# EAGLE design Tracksoar v2  (EAGLE 9.3.0)
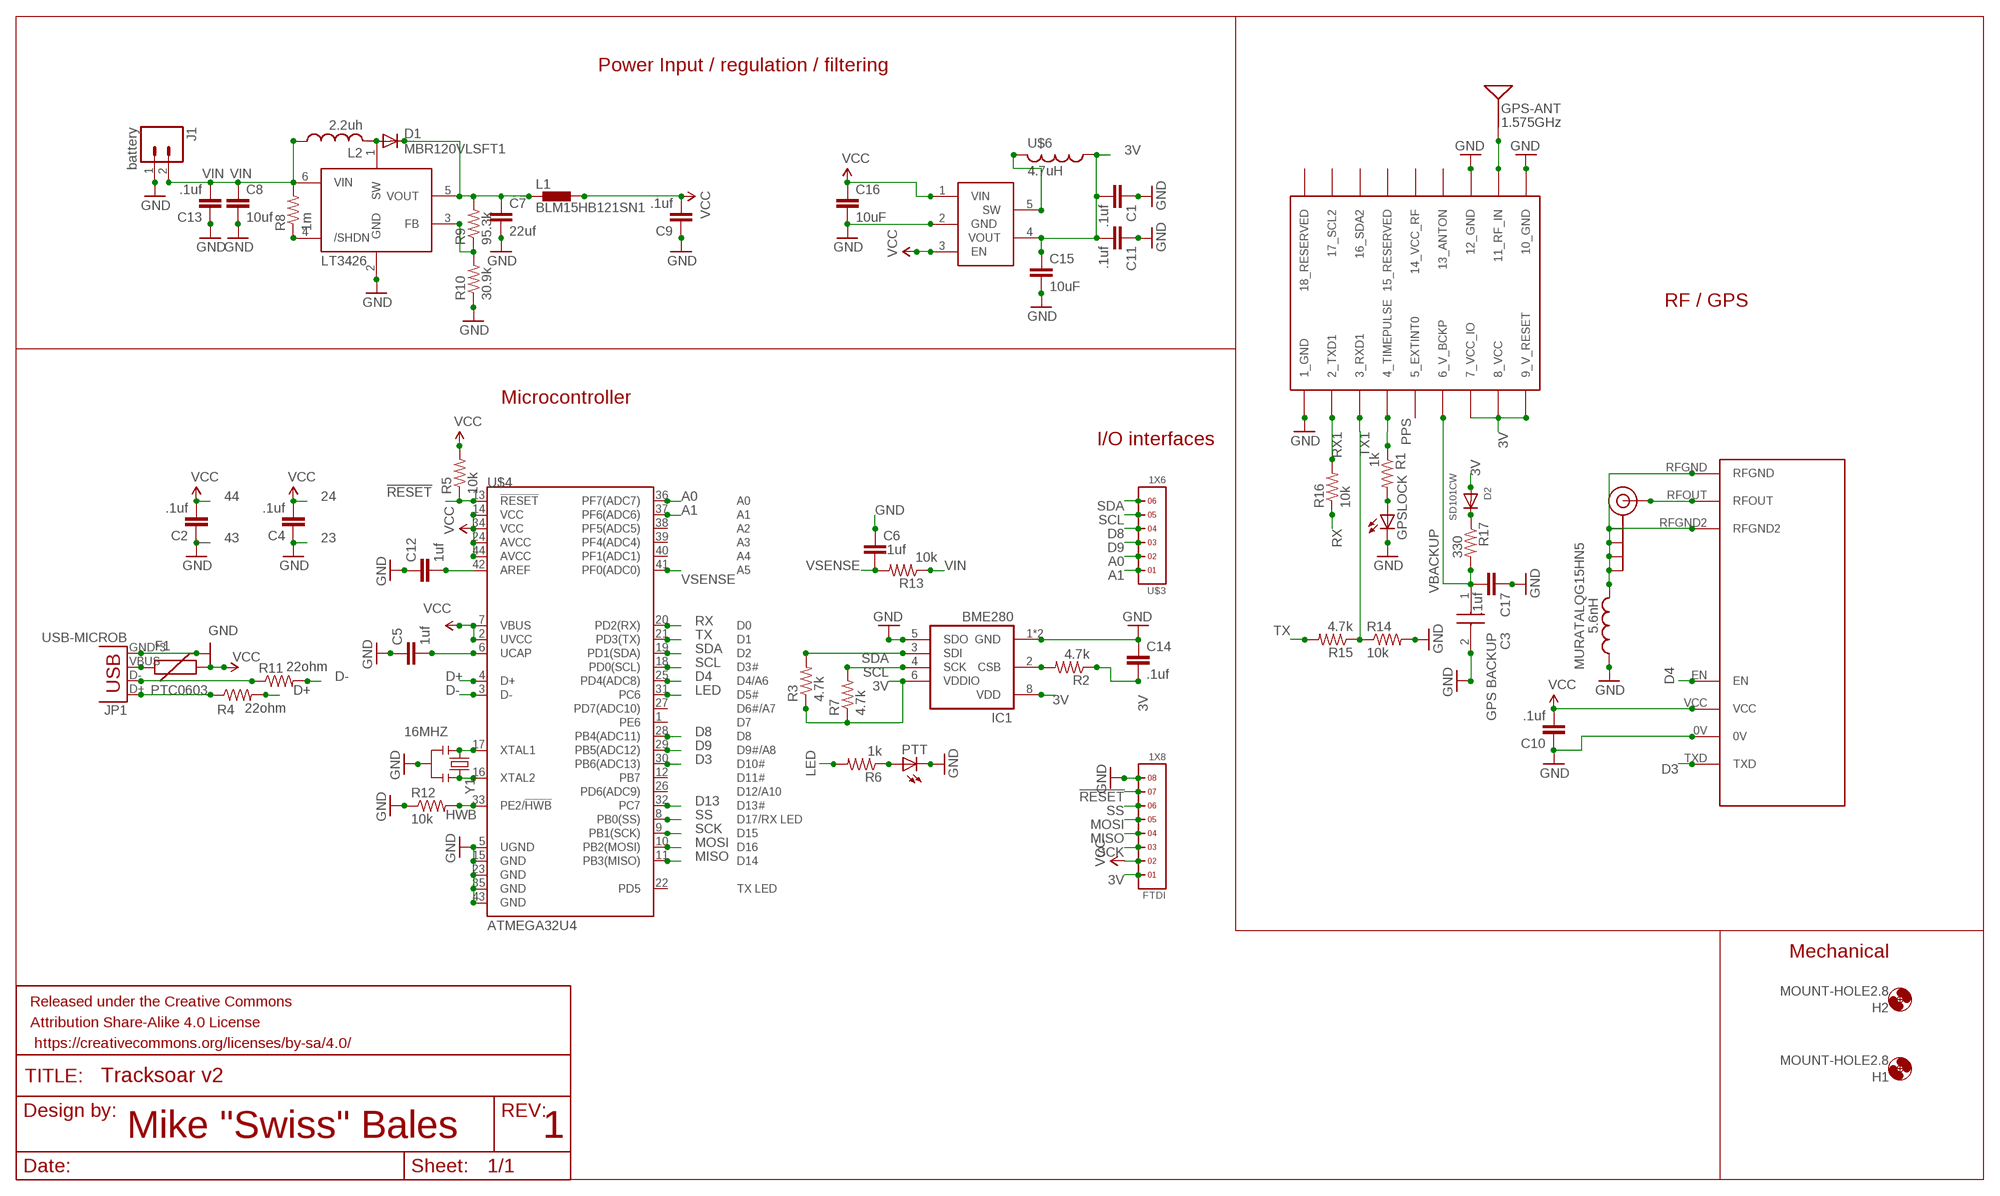
[diagram p0: schematic, sheet 1]

## Parts
C1  .1uf  CAP0402-CAP  [0402-CAP]
C2  .1uf  CAP0402-CAP  [0402-CAP]
C3  GPS BACKUP  DSK-3R3H204T614-H2L  [DSK-3R3H204T614-H2L]
C4  .1uf  CAP0402-CAP  [0402-CAP]
C5  1uf  CAP0402-CAP  [0402-CAP]
C6  .1uf  CAP0402-CAP  [0402-CAP]
C7  22uf  CAP0805  [0805]
C8  10uf  CAP0805  [0805]
C9  .1uf  CAP0402-CAP  [0402-CAP]
C10  .1uf  CAP0402-CAP  [0402-CAP]
C11  .1uf  CAP0402-CAP  [0402-CAP]
C12  1uf  CAP0402-CAP  [0402-CAP]
C13  .1uf  CAP0402-CAP  [0402-CAP]
C14  .1uf  CAP0402-CAP  [0402-CAP]
C15  10uF  10UF-0603-6.3V-20%  [0603]
C16  10uF  10UF-0603-6.3V-20%  [0603]
C17  .1uf  CAP0402-CAP  [0402-CAP]
D1  MBR120VLSFT1  DIODE-SOD123  [SOD123]
D2  SD101CW  DIODESOD-123  [SOD-123]
F1  PTC0603  [0603]
FRAME1  FRAME-LETTER  [CREATIVE_COMMONS]
FTDI  1X8  [1X8]
GPS-ANT  1.575GHz  ANTENNAGPS-2X7MM  [ANT-GPS-2X7MM]
GPSLOCK  LEDCHIP-LED0603  [CHIP-LED0603]
H1  MOUNT-HOLE2.8  [2,8]
H2  MOUNT-HOLE2.8  [2,8]
IC1  BME280  [BME280]
J1  battery  M02JST-PTH-2  [JST-2-PTH]
J$1  SMA_EDGE  [SMA-EDGE]
JP1  USB-MICROB  [USB-MICROB]
L1  BLM15HB121SN1  [0402]
L2  2.2uh  L-USL1812  [L1812]
LT3426  LT3426  [SOT23-6]
MURATALQG15HN5  5.6nH  INDUCTOR_0402_N  [RESC0402_N]
PTT  LEDCHIP-LED0603  [CHIP-LED0603]
R1  1k  R-US_R0402  [R0402]
R2  4.7k  R-US_R0402  [R0402]
R3  4.7k  R-US_R0402  [R0402]
R4  22ohm  R-US_R0402  [R0402]
R5  10k  R-US_R0402  [R0402]
R6  1k  R-US_R0402  [R0402]
R7  4.7k  R-US_R0402  [R0402]
R8  1m  R-US_R0402  [R0402]
R9  95.3k  R-US_R0402  [R0402]
R10  30.9k  R-US_R0402  [R0402]
R11  22ohm  R-US_R0402  [R0402]
R12  10k  R-US_R0402  [R0402]
R13  10k  R-US_R0402  [R0402]
R14  10k  R-US_R0402  [R0402]
R15  4.7k  R-US_R0402  [R0402]
R16  10k  R-US_R0402  [R0402]
R17  330  R-US_R0402  [R0402]
U$1  UBLOX_MAX  [UBLOX_MAX]
U$2  RADIOMETRIX-HX1  [RADIOMETRIX-HX1]
U$3  1X6  [1X6]
U$4  ATMEGA32U4  ATMEGA32U4QFN2  [QFN-44-NOPAD]
U$5  PAM2305  PAM2305-33SOT23-5  [DBV_R-PDSO-G5]
U$6  4.7uH  INDUCTOR_0805_N  [RESC0805_N]
Y1  16MHZ  RESONATOR16MHZ  [RESONATOR-SMD]

## Nets
3V: C1.2 C11.2 C14.2 C15.1 D2.A FTDI.1 IC1.6(VDDIO) IC1.8(VDD) R2.1 R3.1 R7.1 U$1.7_VCC_IO U$1.8_VCC U$1.9_V_RESET U$5.4(VOUT) U$6.1
!RESET: FTDI.7 R5.1 U$4.13(!RESET)
A0: U$3.2 U$4.36(PF7(ADC7))
A1: U$3.1 U$4.37(PF6(ADC6))
D3: U$2.TXD U$4.30(PB6(ADC13))
D4: U$2.EN U$4.25(PD4(ADC8))
D8: U$3.4 U$4.28(PB4(ADC11))
D9: U$3.3 U$4.29(PB5(ADC12))
D13: U$4.32(PC7)
D+: R4.2 U$4.4(D+)
D-: R11.2 U$4.3(D-)
GND: C1.1 C2.1 C3.2(-) C4.1 C5.1 C6.1 C7.2 C8.2 C9.1 C10.1 C11.1 C12.1 C13.1 C14.1 C15.2 C16.2 C17.1 FTDI.8 GPSLOCK.C IC1.1(GND) IC1.5(SDO) IC1.7(GND) J1.1 JP1.GND JP1.MT1(GND) JP1.MT2(GND) LT3426.2(GND) MURATALQG15HN5.1 PTT.C R10.1 R12.1 R14.2 U$1.1_GND U$1.10_GND U$1.12_GND U$2.0V U$4.5(UGND) U$4.15(GND) U$4.23(GND) U$4.35(GND) U$4.43(GND) U$5.2(GND) Y1.2
HWB: R12.2 U$4.33(PE2/!HWB)
LED: R6.2 U$4.31(PC6)
MISO: FTDI.4 U$4.11(PB3(MISO))
MOSI: FTDI.5 U$4.10(PB2(MOSI))
N$1: J$1.SIG(SIGNAL) U$2.RFOUT
N$2: IC1.2(CSB) R2.2
N$3: GPSLOCK.A R1.2
N$6: GPS-ANT.1(SIGNAL) U$1.11_RF_IN
N$7: JP1.D- R11.1
N$8: JP1.D+ R4.1
N$9: D1.A L2.2 LT3426.1(SW)
N$12: LT3426.4(/SHDN) R8.1
N$13: LT3426.3(FB) R9.1 R10.2
N$14: F1.1 JP1.VBUS
N$17: C12.2 U$4.42(AREF)
N$19: C7.1 D1.C L1.1 LT3426.5(VOUT) R9.2
N$20: C5.2 U$4.6(UCAP)
N$21: U$5.5(SW) U$6.2
N$22: D2.C R17.1
N$27: PTT.A R6.1
PPS: R1.1 U$1.4_TIMEPULSE
RFGND: J$1.GND@0(GND) J$1.GND@1(GND) J$1.GND@2(GND) J$1.GND@3(GND) MURATALQG15HN5.2 U$2.RFGND U$2.RFGND2
RX: R16.1 U$4.20(PD2(RX))
RX1: R16.2 U$1.2_TXD1
SCK: FTDI.3 U$4.9(PB1(SCK))
SCL: IC1.4(SCK) R7.2 U$3.5 U$4.18(PD0(SCL))
SDA: IC1.3(SDI) R3.2 U$3.6 U$4.19(PD1(SDA))
SS: FTDI.6 U$4.8(PB0(SS))
TX: R15.2 U$4.21(PD3(TX))
TX1: R14.1 R15.1 U$1.3_RXD1
VBACKUP: C3.1(+) C17.2 R17.2 U$1.6_V_BCKP
VCC: C2.2 C4.2 C9.2 C10.2 C16.1 F1.2 FTDI.2 L1.2 R5.2 U$2.VCC U$4.2(UVCC) U$4.7(VBUS) U$4.14(VCC) U$4.24(AVCC) U$4.34(VCC) U$4.44(AVCC) U$5.1(VIN) U$5.3(EN)
VIN: C8.1 C13.2 J1.2 L2.1 LT3426.6(VIN) R8.2 R13.1
VSENSE: C6.2 R13.2 U$4.41(PF0(ADC0))
XTAL1: U$4.17(XTAL1) Y1.1
XTAL2: U$4.16(XTAL2) Y1.3
Unconnected: U$1.5_EXTINT0 U$1.13_ANTON U$1.14_VCC_RF U$1.15_RESERVED U$1.16_SDA2 U$1.17_SCL2 U$1.18_RESERVED U$4.1(PE6) U$4.12(PB7) U$4.22(PD5) U$4.26(PD6(ADC9)) U$4.27(PD7(ADC10)) U$4.38(PF5(ADC5)) U$4.39(PF4(ADC4)) U$4.40(PF1(ADC1))

## Notes on the sheet
- Power Input / regulation / filtering
- RF / GPS
- Microcontroller
- I/O interfaces
- 44 | 24
- 43 | 23
- Mechanical
- Mike "Swiss" Bales | 1

## Library data of the parts
C1 C2 C4 C5 C7-C14 C17 = SparkFun-Capacitors:CAP: Capacitor Standard 0603 ceramic capacitor, and 0.1" leaded capacitor.
C3 = DSK-3R3H204T614-H2L:DSK-3R3H204T614-H2L: Coin cell capacitor Source: Datasheet <http://www.elna.co.jp/en/capacitor/double_layer/catalog/pdf/ds_e.pdf>; ARROW_PART_NUMBER: DSK-3R3H204T614-H2L; DESCRIPTION: Coin cell capacitor; HEIGHT: mm; MANUFACTURER_NAME: Elna; MANUFACTURER_PART_NUMBER: DSK-3R3H204T614-H2L
C6 = SparkFun-Passives:CAP: Capacitor Standard 0603 ceramic capacitor, and 0.1" leaded capacitor.
C15 C16 = SparkFun-Capacitors:10UF: 10.0µF ceramic capacitors A capacitor is a passive two-terminal electrical component used to store electrical energy temporarily in an electric field.; PROD_ID: CAP-11015
D1 = diode:DIODE-: DIODE
D2 = adafruit:DIODE: Diode SMADIODE - SMA Surface Mount Package 20V 1A Schottky Diode Digikey: 641-1014-6-ND DO-1N4148 - Through Hole Small Current Diode SOD-123 20V 1 A (.5mV Vf) Schottky Diode - Digikey: MBRX120TPMSCT-ND SOD-323 10V 570mA (.38mV Vf, 3ns) Schottky Diode - Digikey: ZLLS410CT-ND SOD-523 30V 30mA Schottky Diode (RB751S-40TE61) - Digikey: RB751S-40TE61CT-ND SOT23-R/W - SOT23 Package (R = Solder Paste/Reflow Ovens, W = Hand-Soldering) BAT54Film 40V 300mA - Digikey: 497-7162-1-ND
F1 = SparkFun-PowerIC:PTC: Resettable Fuse PTC Resettable Fuse. Spark Fun Electronics SKU : COM-08357
FRAME1 = SparkFun-Aesthetics:FRAME-LETTER: Schematic Frame Standard 8.5x11 US Letter frame
FTDI = headers(2mm):1X8
GPS-ANT = SparkFun-GPS:ANTENNA: Single-ended Antennae 1.575GHz antennae with just one terminal. These are all chip antennae. 1575MHz (GPS) Antennae ANT-GPS-2X7MM - 2.0 x 7.0 mm chip antenna. (SparkFun Product <https://www.sparkfun.com/products/9131>) ANT-GPS-2X8MM - 2.0 x 8.0 mm chip antenna. (SparkFun Product <https://www.sparkfun.com/products/8418>); PROD_ID: ANT-09087; SF_ID: GPS-09131
GPSLOCK PTT = adafruit:LED: LED OSRAM: - CHIPLED LG R971, LG N971, LY N971, LG Q971, LY Q971, LO R971, LY R971 LH N974, LH R974 LS Q976, LO Q976, LY Q976 LO Q996 - Hyper CHIPLED LW Q18S LB Q993, LB Q99A, LB R99A - SideLED LS A670, LO A670, LY A670, LG A670, LP A670 LB A673, LV A673, LT A673, LW A673 LH A674 LY A675 LS A676, LA A676, LO A676, LY A676, LW A676 LS A679, LY A679, LG A679 - Hyper Micro SIDELED® LS Y876, LA Y876, LO Y876, LY Y876 LT Y87S - SmartLED LW L88C, LW L88S LB L89C, LB L89S, LG L890 LS L89K, LO L89K, LY L89K LS L896, LA L896, LO L896, LY L896 - TOPLED LS T670, LO T670, LY T670, LG T670, LP T670 LSG T670, LSP T670, LSY T670, LOP T670, LYG T670 LG T671, LOG T671, LSG T671 LB T673, LV T673, LT T673, LW T673 LH T674 LS T676, LA T676, LO T676, LY T676, LB T676, LH T676, LSB T676, LW T676 LB T67C, LV T67C, LT T67C, LS T67K, LO T67K, LY T67K, LW E67C LS E67B, LA E67B, LO E67B, LY E67B, LB E67C, LV E67C, LT E67C LW T67C LS T679, LY T679, LG T679 LS T770, LO T770, LY T770, LG T770, LP T770 LB T773, LV T773, LT T773, LW T773 LH T774 LS E675, LA E675, LY E675, LS T675 LS T776, LA T776, LO T776, LY T776, LB T776 LHGB T686 LT T68C, LB T68C - Hyper Mini TOPLED® LB M676 - Mini TOPLED Santana® LG M470 LS M47K, LO M47K, LY M47K Source: http://www.osram.convergy.de/
H1 H2 = holes:MOUNT-HOLE: MOUNTING HOLE with drill center marker
IC1 = bosch-bme280:BME280: DIGITAL HUMIDITY, PRESSURE AND TEMPERATURE SENSOR * Digital interface I²C (up to 3.4 MHz) and SPI (3 and 4 wire, up to 10 MHz)* Supply voltage VDD main supply voltage range: 1.71 V to 3.6 V*VDDIO interface voltage range: 1.2 V to 3.6 V Operating range -40…+85 °C, 0…100 % rel. humidity, 300…1100 hPa The library has been designed by Richard Magdycz <https://www.facebook.com/groups/eaglecadsoftUK>
J1 = SparkFun-Connectors:M02: Standard 2-pin 0.1" header. Use with - straight break away headers ( PRT-00116) - right angle break away headers (PRT-00553) - swiss pins (PRT-00743) - machine pins (PRT-00117) - female headers (PRT-00115) Molex polarized connector foot print use with: PRT-08233 with associated crimp pins and housings. 2.54_SCREWTERM for use with PRT-10571. 3.5mm Screw Terminal footprints for PRT-08084 5mm Screw Terminal footprints for use with PRT-08432; PROD_ID: CONN-09863; SKU: PRT-09914
J$1 = SparkFun-Connectors:SMA_EDGE: SMA Antenna Connector End launch SMA connector. The paste layer has been removed so that the connector can be hand soldered onto the board after reflow.
JP1 = SparkFun-Connectors:USB: USB Connectors USB-B-PTH is fully proven SKU : PRT-00139/CONN-08278 USB-miniB is fully proven SKU : PRT-00587 USB-A-PCB is untested. USB-A-H is throughly reviewed, but untested. Spark Fun Electronics SKU : PRT-00437 USB-B-SMT is throughly reviewed, but untested. Needs silkscreen touching up. USB-A-S has not been used/tested USB-MB-H has not been used/tested USB-MICROB has been used. CONN-09505; PROD_ID: CONN-09505
L1 = inductors:BLM15H: EMIFIL (R) Chip Ferrite Bead for GHz Noise Source: http://www.murata.com/ Ferrite Bead BLM15H.pdf
L2 = resistor:L-US: INDUCTOR, American symbol
LT3426 = adafruit:LT3426: LT3426 1.2MHz, 2A boost converter in SOT-23 http://www.linear.com/pc/productDetail.jsp?navId=H0,C1,C1003,C1042,C1031,C1061,P8430 (Linear website)
MURATALQG15HN5 U$6 = Nordic_nRF:INDUCTOR: Generic chip inductor
R1-R17 = adafruit:R-US_: RESISTOR, American symbol
U$1 = Ava:UBLOX_MAX: UBLOX MAX
U$2 = Ava:RADIOMETRIX-HX1
U$3 = headers(2mm):1X6
U$4 = SparkFun-DigitalIC:ATMEGA32U4: Atmel 44-pin 8-bit Microcontroller with 32KBytes of ISP Flash and USB Controller
U$5 = PAM2305-33:PAM2305-33
Y1 = SparkFun-FreqCtrl:RESONATOR: Resonator Small SMD resonator. Used, eg, on the Arduino Pro/ Pro Mini boards. 8MHz- XTAL-08895 16MHz- XTAL-08900; PROD_ID: XTAL-08900

## Board
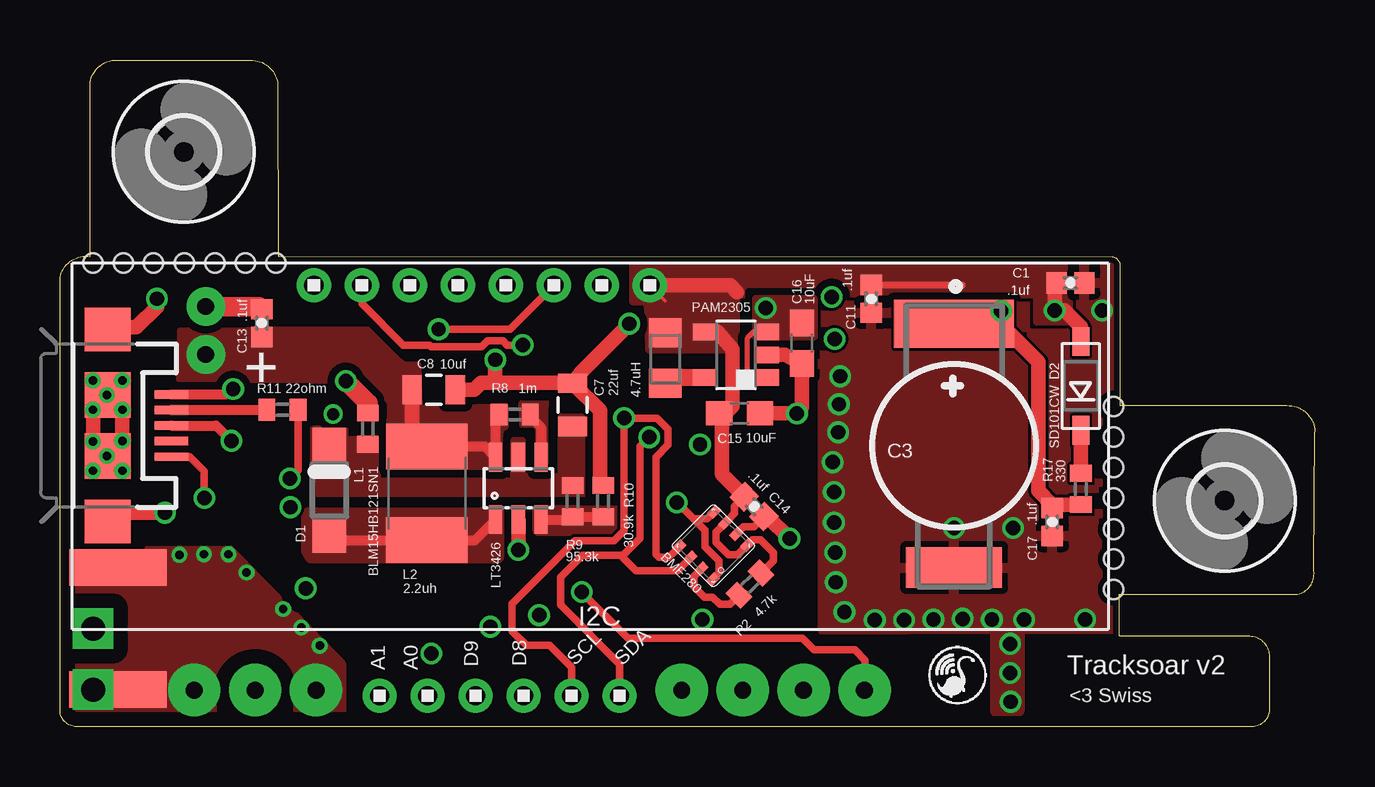
[diagram p1: board, top side]
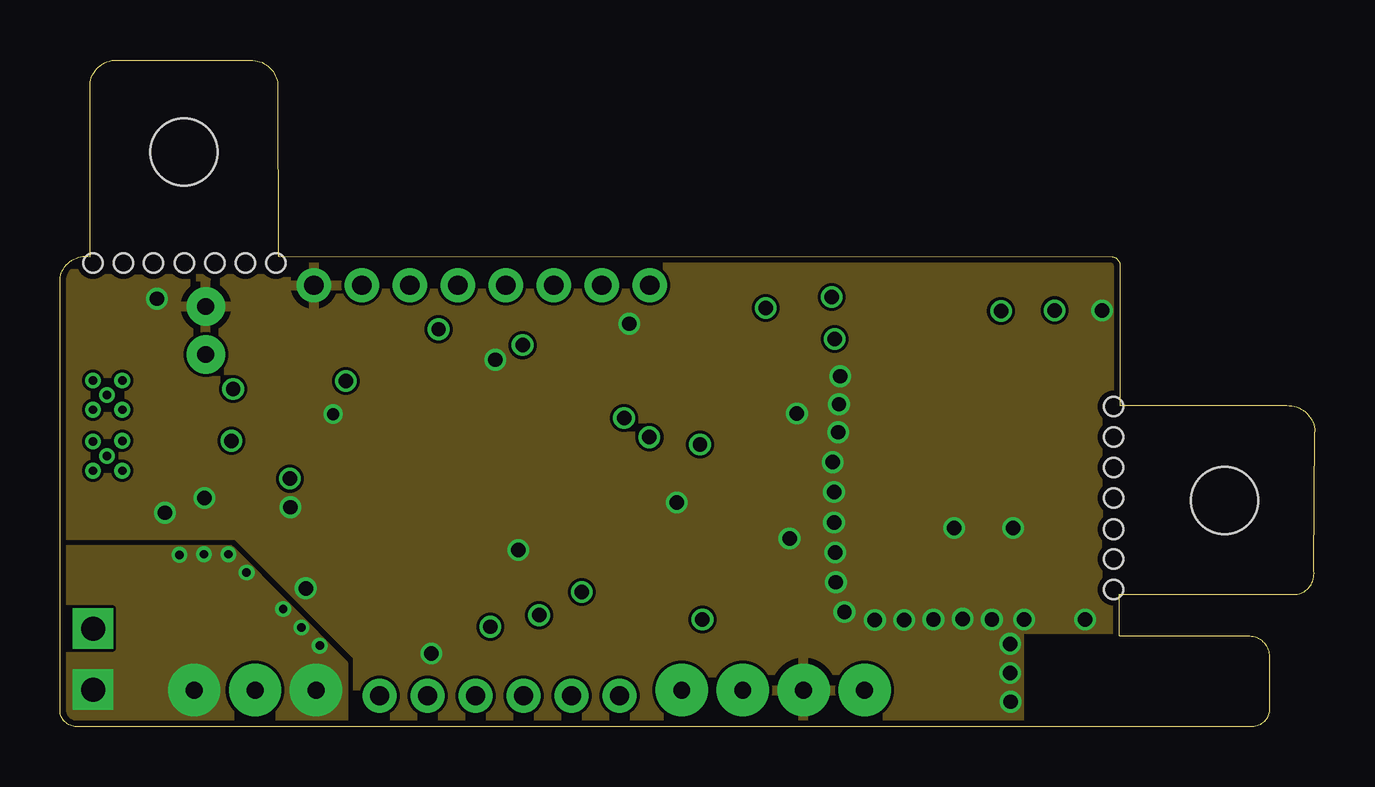
[diagram p2: board, inner layer Route2]
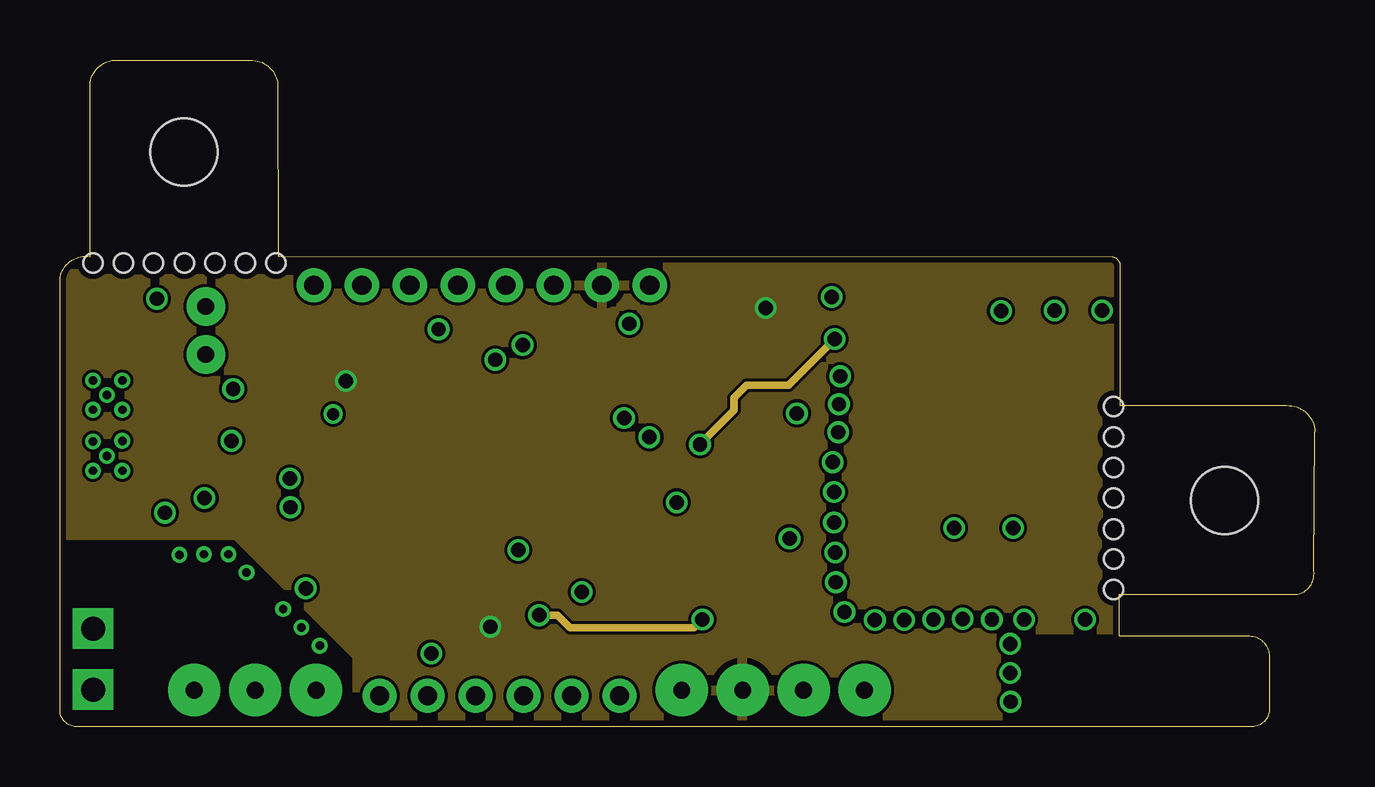
[diagram p3: board, inner layer Route15]
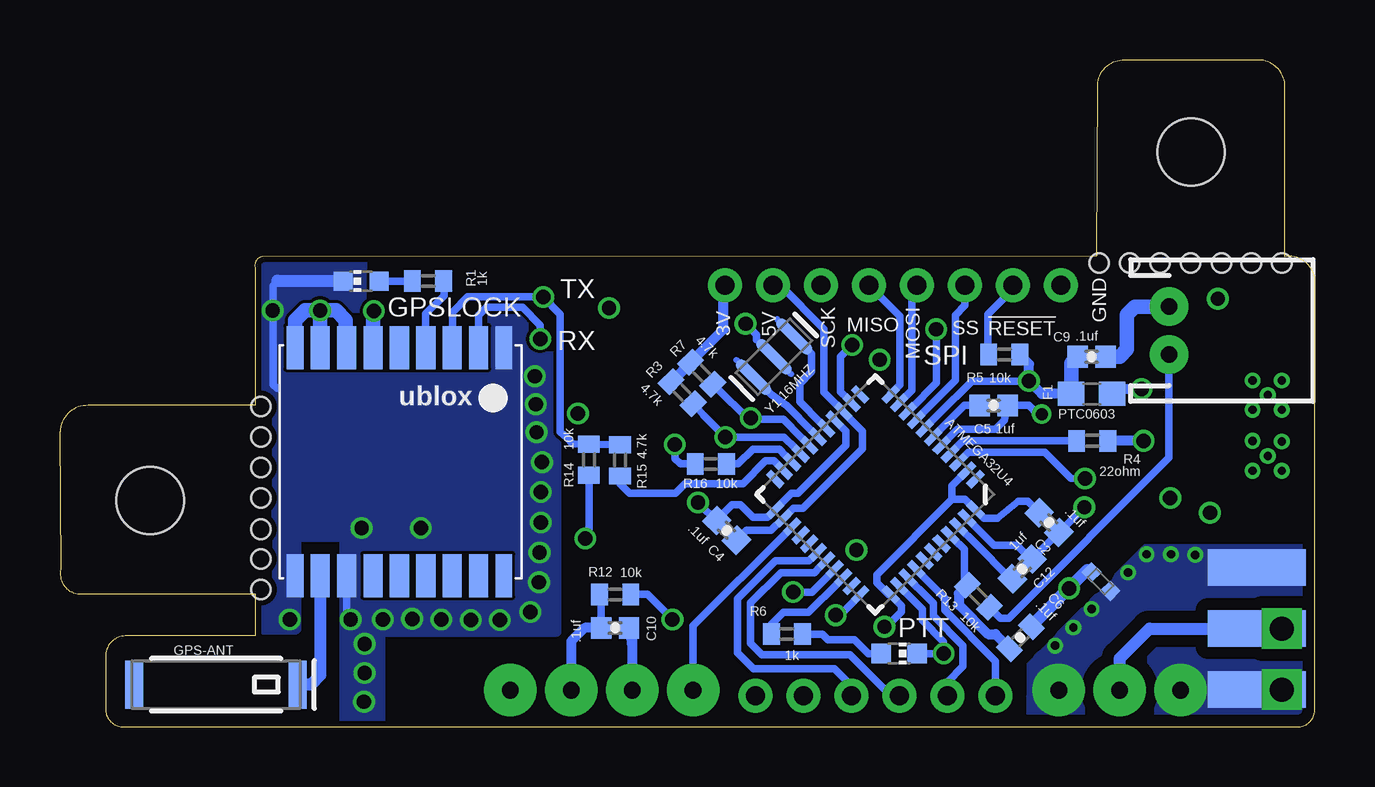
[diagram p4: board, bottom side, seen from below]

Size 52.31 x 27.78 mm. Coordinates in mm from the lower left corner, seen from the top.
Outline: 0.62,0 arc-90 0.01,0.81 0.01,18.72 arc-90 1.25,19.58 1.25,26.85 arc-90 2.57,27.76 7.93,27.76 arc-90 9.07,26.75 9.1,19.68 arc90 9.13,19.61 43.87,19.58 arc-90 44.18,19.15 44.18,13.39 51.14,13.39 arc-90 52.31,12.29 52.25,6.55 arc-90 51.57,5.51 44.15,5.51 44.15,3.79 49.59,3.79 arc-90 50.4,2.92 50.4,0.84 arc-90 49.77,0 0.62,0
Copper layers (1*2*15*16): Top 0.035mm / dielectric 0.23mm / Route2 0.035mm / dielectric 0.93mm / Route15 0.035mm / dielectric 0.23mm / Bottom 0.035mm
Design rules "MF_Standard_4_Layer": minimum track width 5mil, minimum drill 12mil, track to track 5mil, track to pad 5mil, pad to pad 5mil, via to via 5mil, smd to smd 0mil, copper to edge 10mil, drill to drill 10mil, minimum pad ring 6mil, minimum via ring 6mil, stop-mask expansion 2mil, vias tented up to drill 25mil, thermal gap 10mil
Holes 0.8 mm at 1.38,19.33 2.65,19.33 3.89,19.33 5.19,19.33 6.46,19.33 7.73,19.33 9,19.33 43.92,5.72 43.92,6.99 43.92,8.23 43.92,9.53 43.92,10.8 43.92,12.06 43.92,13.34

### Footprints (pad centres in the part's own frame; a part is rotated, then mirrored left to right if it is on the bottom)
0402-CAP = smd 0.85 x 0.9: 1 -0.58,0; 2 0.58,0
DSK-3R3H204T614-H2L = smd 5 x 2: 1 0,5.075 | smd 4 x 1.7: 2 0,-5.075
0402-CAP' = smd 0.7 x 0.9: 1 -0.65,0; 2 0.65,0
0805 = smd 0.8 x 1.2: 1 -0.9,0; 2 0.9,0
0603 = smd 1.1 x 1: 1 -0.85,0; 2 0.85,0
SOD123 = smd 1.4 x 1.4: A 1.9,0; C -1.9,0
SOD-123 = smd 1.2 x 0.7: A 1.85,0; C -1.85,0
1X8 = drill 0.8 pad 1.422: 1 -7,0; 2 -5,0; 3 -3,0; 4 -1,0; 5 1,0; 6 3,0; 7 5,0; 8 7,0
ANT-GPS-2X7MM = smd 0.75 x 2: 1 -3.4,0; NC 3.4,0
CHIP-LED0603 = smd 0.8 x 0.8: A 0,-0.75; C 0,0.75
2,8 = hole 2.8: 0,0
BME280 = smd 0.35 x 0.5: 1 0.975,-1.025; 2 0.325,-1.025; 3 -0.325,-1.025; 4 -0.975,-1.025; 5 -0.975,1.025; 6 -0.325,1.025; 7 0.325,1.025; 8 0.975,1.025
JST-2-PTH = drill 0.7 pad 1.6: 1 -1,0; 2 1,0
SMA-EDGE = smd 1.524 x 4.064: GND@0 0,0; GND@1 5.08,0; SIG 2.54,0 | smd 1.524 x 4.064 bottom: GND@2 0,0; GND@3 5.08,0
USB-MICROB = smd 0.35 x 1.4: D+ 0,2.65; D- -0.65,2.65; GND 1.3,2.65; ID 0.65,2.65; VBUS -1.3,2.65 | smd 1.8 x 1.9: MT1 -4,0; MT2 4,0 | smd 1.9 x 1.9: P$1 -1.27,0; P$2 1.27,0
0402 = smd 0.7 x 0.9: 1 -0.65,0; 2 0.65,0
L1812 = smd 1.9 x 3.4: 1 -1.95,0; 2 1.95,0
SOT23-6 = smd 0.55 x 1.2: 1 -0.95,-1.3; 2 0,-1.3; 3 0.95,-1.3; 4 0.95,1.3; 5 0,1.3; 6 -0.95,1.3
RESC0402_N = smd 0.6 x 0.6: 1 -0.55,0; 2 0.55,0
R0402 = smd 0.7 x 0.9: 1 -0.65,0; 2 0.65,0
UBLOX_MAX = smd 1.8 x 0.7: 1_GND 4.95,-4.4; 9_V_RESET 4.95,4.3; 10_GND -4.55,4.3; 18_RESERVED -4.55,-4.4 | smd 1.8 x 0.8: 2_TXD1 4.95,-3.35; 3_RXD1 4.95,-2.25; 4_TIMEPULSE 4.95,-1.15; 5_EXTINT0 4.95,-0.05; 6_V_BCKP 4.95,1.05; 7_VCC_IO 4.95,2.15; 8_VCC 4.95,3.25; 11_RF_IN -4.55,3.25; 12_GND -4.55,2.15; 13_ANTON -4.55,1.05; 14_VCC_RF -4.55,-0.05; 15_RESERVED -4.55,-1.15; 16_SDA2 -4.55,-2.25; 17_SCL2 -4.55,-3.35
RADIOMETRIX-HX1 = drill 0.7 pad 2.184: 0V 8.89,-10.16; EN 3.81,-10.16; RFGND -11.43,-10.16; RFGND2 -16.51,-10.16; RFOUT -13.97,-10.16; TXD 11.43,-10.16; VCC 6.35,-10.16
1X6 = drill 0.8 pad 1.422: 1 -5,0; 2 -3,0; 3 -1,0; 4 1,0; 5 3,0; 6 5,0
QFN-44-NOPAD = smd 0.8 x 0.3: 1 -3.4,2.5; 2 -3.4,2; 3 -3.4,1.5; 4 -3.4,1; 5 -3.4,0.5; 6 -3.4,0; 7 -3.4,-0.5; 8 -3.4,-1; 9 -3.4,-1.5; 10 -3.4,-2; 11 -3.4,-2.5; 23 3.4,-2.5; 24 3.4,-2; 25 3.4,-1.5; 26 3.4,-1; 27 3.4,-0.5; 28 3.4,0; 29 3.4,0.5; 30 3.4,1; 31 3.4,1.5; 32 3.4,2; 33 3.4,2.5 | smd 0.3 x 0.8: 12 -2.5,-3.4; 13 -2,-3.4; 14 -1.5,-3.4; 15 -1,-3.4; 16 -0.5,-3.4; 17 0,-3.4; 18 0.5,-3.4; 19 1,-3.4; 20 1.5,-3.4; 21 2,-3.4; 22 2.5,-3.4; 34 2.5,3.4; 35 2,3.4; 36 1.5,3.4; 37 1,3.4; 38 0.5,3.4; 39 0,3.4; 40 -0.5,3.4; 41 -1,3.4; 42 -1.5,3.4; 43 -2,3.4; 44 -2.5,3.4
DBV_R-PDSO-G5 = smd 0.69 x 0.99: 1 -0.95,-1.29; 2 0,-1.29; 3 0.95,-1.29; 4 0.95,1.3; 5 -0.95,1.3
RESC0805_N = smd 1.2 x 1.35: 1 -1.1,0; 2 1,0
RESONATOR-SMD = smd 0.45 x 1.905: 1 -1.2,0; 2 0,0; 3 1.2,0

### Placement (x,y rotation side)
C1  42.12,18.49 180 top
C2  11.08,8.51 135 bottom
C3  37.27,11.71 0 top
C4  24.52,8.18 315 bottom
C5  13.39,13.39 180 bottom
C6  .1uf  [0402-CAP']  12.27,3.71 225 bottom
C7  21.37,13.41 90 top
C8  15.58,14.05 0 top
C9  9.3,15.42 180 bottom
C10  29.17,4.11 0 bottom
C11  33.81,17.83 90 top
C12  12.2,6.58 225 bottom
C13  8.41,16.81 270 top
C14  28.94,9.17 135 top
C15  28.33,13.06 0 top
C16  30.92,15.98 270 top
C17  41.36,8.53 90 top
D1  11.23,9.86 270 top
D2  42.55,14.2 90 top
F1  9.3,13.87 180 bottom
FRAME1  9.91,-12.98 0 top  (outside the outline)
FTDI  17.58,18.39 180 top
GPS-ANT  45.8,1.75 180 bottom
GPSLOCK  39.76,18.57 90 bottom
H1  5.16,23.95 0 top
H2  48.55,9.42 0 top
IC1  27.24,7.54 315 top
J1  6.08,16.51 270 bottom
J$1  2.42,1.55 90 bottom
JP1  1.99,12.55 270 top
L1  12.83,12.42 90 top
L2  15.3,9.73 270 top
LT3426  19.11,9.93 0 top
MURATALQG15HN5  8.92,6.05 315 bottom
PTT  17.33,3.05 270 bottom
R1  36.96,18.57 180 bottom
R2  28.76,5.94 225 top
R3  26.37,13.92 315 bottom
R4  9.28,11.91 180 bottom
R5  12.95,15.5 0 bottom
R6  22,3.86 180 bottom
R7  25.56,14.73 315 bottom
R8  18.95,13 180 top
R9  21.37,9.4 90 top
R10  22.64,9.4 270 top
R11  9.28,13.21 0 top
R12  29.17,5.51 0 bottom
R13  14.03,5.44 135 bottom
R14  30.26,11.13 270 bottom
R15  28.96,11.1 270 bottom
R16  25.18,10.95 180 bottom
R17  42.55,9.91 270 top
U$1  38.21,10.85 90 bottom
U$2  22.1,11.68 0 top
U$3  18.32,1.3 0 top
U$4  18.32,9.68 225 bottom
U$5  28.18,15.49 90 top
U$6  25.23,15.32 270 top
Y1  22.55,15.42 45 bottom

### Tracks (layer width: path | path; a pad name or v marks a point on that pad's centre or on a via)
3V  (via drill 0.6)
  Top 0.152: 25.26,16.44 U$6.1 | 25.23,17.74 FTDI.1
  Top 0.305: 41.47,17.36 v41.46,17.35 | IC1.6 27.34,8.11 27.34,7.7 27.87,7.16 28.28,7.16 28.28,7.21 IC1.8 | 29.35,6.53 29.75,6.91 29.75,7.24 29.19,7.8 28.87,7.8 28.76,7.69 IC1.8 | 29.35,6.53 R2.1 29.35,6.53 | 37.59,18.4 C11.2 | 41.52,18.51 C1.2 | 28.3,9.81 C14.2 28.12,9.18 28.12,8.89 27.84,8.61 IC1.6 | IC1.8 | IC1.6
  Top 0.61: C1.2 41.46,18.49 41.46,17.36 41.47,17.36 41.86,17.36 42.55,16.66 D2.A | C14.2 28.3,9.81 27.59,10.53 27.59,12.9 | 28.23,18.11 27.95,18.39 FTDI.1 | 27.59,12.9 28.02,13.36 28.02,15.72 27.41,16.46 27.4,16.44 U$5.4 | C15.1 27.48,13.01 27.59,12.9
  Bottom 0.305: U$1.8_VCC | 24.64,18.12 FTDI.1 | R3.1 26.81,14.38 26.37,14.81 | R7.1 25.57,15.63
  Bottom 0.406: R3.1 26.37,14.81 R7.1 25.57,15.63 24.64,16.56 24.64,18.12
  Bottom 0.61: v41.46,17.35 U$1.8_VCC | U$1.9_V_RESET 42.51,16.93 42.09,17.35 v41.46,17.35 | U$1.7_VCC_IO 40.39,15.83 40.39,16.94 40.8,17.35 v41.46,17.35
  pour Top (isolate 0.305, rank 3, no thermals): 23.88,19.33 42.07,19.33 42.07,16.87 40.72,16.87 40.72,18.01 28.18,18.01 28.18,15.7 24.54,15.7 24.49,17.7 23.88,17.7
!RESET  (via drill 0.6)
  Top 0.305: FTDI.7 12.58,17.62 14.31,15.9 15.41,15.9 15.48,15.83 17.57,15.83 17.81,16.07 18.47,16.07 18.64,15.9 v19.29,15.9
  Bottom 0.254: U$4.13 19.47,13.66
  Bottom 0.305: U$4.13 19.47,13.66 19.77,13.95 19.77,15.42 v19.29,15.9 | FTDI.7 12.58,18.23 13.62,17.2 13.62,15.53 R5.1
A0
  Bottom 0.152: 16.8,6.04 U$4.36 16.79,6.03
  Bottom 0.305: U$4.36 16.09,5.33 | 16.09,5.33 15.91,5.14 15.91,4.62 14.66,3.38 14.66,2.52 15.32,1.86 U$3.2 | U$4.36 16.68,5.91 | U$4.36 16.09,5.33
A1
  Bottom 0.152: U$4.37
  Bottom 0.305: U$3.1 13.32,2.72 15.42,4.85 15.42,5.36 U$4.37
D3  (via drill 0.6)
  Top 0.305: v21.75,5.61 23.68,3.68 30.94,3.68 31.43,3.2 33.13,3.2 33.56,2.77 33.56,1.55 U$2.TXD
  Bottom 0.254: U$4.30 20.24,6.34
  Bottom 0.305: U$4.30 20.24,6.34 20.96,5.61 v21.75,5.61
D4
  Bottom 0.254: U$4.25 22.01,8.11 | 22.01,8.11
  Bottom 0.305: U$4.25 22.01,8.11 25.91,4.2 U$2.EN
D8
  Bottom 0.254: U$4.28 20.96,7.04
  Bottom 0.305: U$4.28 20.96,7.04 21.09,6.91 22.49,6.91 24.06,5.33 24.06,3.07 23.4,2.41 20.02,2.41 19.32,1.71 U$3.4
D9
  Bottom 0.254: U$4.29 20.63,6.66
  Bottom 0.305: U$4.29 20.63,6.66 20.86,6.43 22.26,6.43 23.53,5.16 23.53,3.48 23.04,3 19.38,3 17.65,1.27 U$3.3
D+
  Bottom 0.254: U$4.4 15.05,11.54
  Bottom 0.305: R4.2 14.67,11.91 15.05,11.54 U$4.4
D-  (via drill 0.6)
  Top 0.305: 9.86,13.14 R11.2 9.93,10.68 v9.58,10.34
  Bottom 0.305: v9.58,10.34 10.17,10.36 11.26,11.43 14.45,11.43 14.63,11.25 U$4.3 | U$4.3
GND  (via drill 0.5, 0.6)
  Top 0.305: C14.1 29.35,8.74 28.94,8.33 28.48,8.33 28.29,8.14 IC1.7 | 27.33,6.27 IC1.1 27.33,6.27 | 27.33,6.27 27.47,6.41 27.47,6.91 26.88,7.51 26.88,8.18 26.4,8.66 | 26.4,8.66 v25.71,9.35 | 27.16,8.84 IC1.5 27.16,8.84 | 27.16,8.84 26.97,8.66 26.4,8.66 | C14.1 29.6,8.51 | 32.52,14.8 v32.52,14.61 | JP1.GND 5.4,11.25 6,10.64 6,9.55 v6.03,9.53 | 18.14,14.4 18.22,14.33 | C14.1 29.5,8.76 | IC1.7 | 27.16,8.84
  Top 0.508: JP1.MT2 2.36,8.91
  Top 0.61: C7.2 21.7,14.76 v23.73,16.79 | R10.1 22.51,10.05 22.51,13.19 C7.2 | C8.2 17.25,14.05 17.56,14.33 18.22,14.33 21.23,14.33 C7.2 | C14.1 29.5,8.76 v30.41,7.85 | 2.36,8.91 v4.38,8.91 | JP1.MT1 2.08,16.64 3.18,16.64 4.05,17.5 v4.05,17.83 | C15.2 30.66,13.06 | 30.66,13.06 v30.72,13.06 | v18.14,15.29 18.14,14.4 | LT3426.2 v19.11,7.37 | 30.66,13.06 30.92,13.31 C16.2 30.22,15.49 U$5.2
  Top 0.813: 6.06,17.53 J1.1 6.68,17.51 6.69,17.5 8.31,17.5 C13.1
  Bottom 0.152: Y1.2 23.26,16.13
  Bottom 0.254: U$4.23 22.51,9.04 22.61,8.94 | C6.1 11.82,4.19 11.55,4.46 | C2.1 10.65,8.1 10.37,8.38 | U$4.15 | C12.1
  Bottom 0.305: U$4.15 19.78,12.56 19.54,12.31 19.54,11.73 21.55,9.73 21.83,9.73 22.49,9.06 | 22.49,9.06 U$4.23 | 15.15,12.14 U$4.5 15.15,12.14 | 15.15,12.14 14.9,12.39 13.32,12.39 12.95,12.77 C5.1 11.92,13.39 11.56,13.03 v11.39,13.03 | 16.78,5.3 U$4.35 16.78,5.3 | U$4.43 13.38,7.57 12.43,7.57 11.85,6.99 C12.1 | v23.73,16.79 23.26,16.32 23.26,16.13 | 11.87,7.01 C12.1 | 22.49,9.06 22.61,8.94 22.82,8.74 23.43,8.74 23.93,9.25 24.29,9.25 24.93,8.61 | 24.93,8.61 C4.1 | R12.1 29.75,5.76 C10.1 | C4.1 25.41,9.04 v25.71,9.35 | R14.2 30.26,8 v30.41,7.85 | PTT.C v15.48,3.05 15.48,3.54 16.36,4.43 16.36,4.89 16.78,5.3 | 43.21,18.57 43.42,18.36 43.42,14.25 43.26,14.1 | U$1.12_GND 40.36,4.67 v40.19,4.47 | v9.61,9.14 10.37,8.38 C2.1 11,7.78 C12.1 | MURATALQG15HN5.1 9.37,6.43 9.47,6.54 | U$4.43 14.24,8.43 | U$4.43 | C4.1 24.93,8.61
  Bottom 0.406: C10.1 30.44,4.12 30.99,3.56 U$2.0V | C6.1 11.76,4.24
  Bottom 0.508: 11.76,4.24 11.55,4.46 v10.24,5.77 | 10.24,5.79 v10.24,5.77 | GPSLOCK.C 43.21,18.57 43.24,18.59 | v10.24,5.77 9.47,6.54 MURATALQG15HN5.1
  Bottom 0.61: C9.1 8.13,15.42 7.83,15.72 7.83,17.17 7.5,17.5 6.09,17.5 J1.1
  other vias: 32.32,7.26 32.34,6.02 32.7,4.78 39.61,2.24 39.61,3.45 42.73,4.47 39.63,1.04 33.97,4.45 35.19,4.45 36.4,4.47 37.62,4.5 38.84,4.47 32.26,8.51 32.26,9.78 32.21,11.02 32.44,12.27 32.47,13.44 37.27,8.28 39.73,8.28 43.44,17.35
  pour Route2: -0.02,19.56 26.35,19.61 32.32,19.56 43.85,19.56 43.85,4.06 39.96,4.06 39.96,0.15 12.43,0 12.43,2.92 7.37,7.98 0.06,7.98
  pour Top (rank 4): 31.81,19.53 43.87,19.58 43.87,4.06 39.99,4.06 39.99,0.64 39.02,0.64 39.02,0.61 39,0.61 39,4.06 31.81,4.01
  pour Bottom (no thermals): 31.6,19.53 43.87,19.58 43.87,4.06 42.45,4.06 42.45,7.87 42.32,7.92 40.49,7.92 40.47,7.82 40.47,0.03 38.94,0.03 38.94,3.96 31.6,3.96
HWB  (via drill 0.6)
  Route15 0.305: v19.97,4.65 20.73,4.65 21.27,4.12 26.42,4.12 v26.78,4.47
  Bottom 0.254: U$4.33 19.2,5.27 19.2,5.25
  Bottom 0.305: U$4.33 18.96,5.49 19.2,5.25 19.79,4.65 v19.97,4.65 | R12.2 27.82,5.51 v26.78,4.47
LED
  Bottom 0.254: U$4.31 19.89,5.99 | 19.89,5.99
  Bottom 0.305: U$4.31 19.89,5.99 21.1,4.78 22.16,4.78 22.65,4.28 R6.2
MISO
  Bottom 0.254: U$4.11 17.57,13.96 17.57,13.98
  Bottom 0.305: 17.58,13.95 U$4.11 17.68,13.87 17.57,13.98 17.3,14.25 17.3,17.11 FTDI.4
MOSI
  Bottom 0.254: U$4.10 17.22,13.61 | 17.22,13.61
  Bottom 0.305: U$4.10 17.22,13.61 16.8,14.03 16.8,17.8 16.58,18.02 FTDI.5
N$1
  Bottom 0.305: J$1.SIG 1.35,4.09 1.35,4.14
  Bottom 0.508: U$2.RFOUT 8.13,2.85 6.89,4.09 1.35,4.09
N$2
  Top 0.305: IC1.2 | 28.19,5.37 27.92,5.1 27.5,5.1 27.2,5.41 26.86,5.41 26.42,5.84 26.42,6.27 26.63,6.48 IC1.2 | 28.19,5.37 R2.2 28.19,5.37 | IC1.2
N$3
  Bottom 0.305: GPSLOCK.A R1.2
N$6
  Bottom 0.305: U$1.11_RF_IN 41.5,6.26
  Bottom 0.508: U$1.11_RF_IN 41.46,2.16 41.87,1.75 GPS-ANT.1
N$7
  Top 0.406: JP1.D- R11.1
N$8  (via drill 0.6)
  Top 0.406: JP1.D+ 6.51,12.55 v7.14,11.91
  Bottom 0.406: v7.14,11.91 R4.1
N$9
  Top 0.406: D1.A 11.92,7.78 L2.2 17.3,7.78 LT3426.1
  pour Top (no thermals): 10.34,8.84 17.81,8.84 18.09,8.89 18.22,8.92 18.22,7.11 10.5,7.11 10.37,7.32 10.37,8.41
N$12
  Top 0.406: R8.1 19.61,12.91 20.05,12.47 LT3426.4
  pour Top (isolate 0.406, rank 3, no thermals): 19.87,12.57 19.31,12.57 19.31,12.67 19.26,13.46 20.3,13.46 20.33,13.41 20.33,10.82 19.89,10.82
N$13
  Top 0.406: LT3426.3 21.37,8.63 R9.1 R10.2
  pour Top (rank 5, no thermals): 20,8.97 23.15,8.92 23.2,8.81 23.22,8.41 23.25,8.25 20.28,8.25 20,8.23
N$14  (via drill 0.6)
  Top 0.406: JP1.VBUS 6.89,13.85 v7.22,14.07
  Bottom 0.406: v7.22,14.07 8.33,14.07 F1.1
N$17
  Bottom 0.254: C12.2 12.69,6.17 12.75,6.23
  Bottom 0.305: U$4.42 14.14,7.61 | 14.14,7.61 12.75,6.23 12.63,6.11 C12.2 | U$4.42 14.63,8.11 | U$4.42 14.14,7.61
N$19
  Top 0.305: D1.C 11.59,11.91 | 12.7,11.91 L1.1
  Top 0.406: 19.08,11.21 LT3426.5
  pour Top (isolate 0.305, no thermals): 20.91,12.9 21.9,12.9 21.9,9.73 10.55,9.73 10.55,12.37 10.62,12.4 11.87,12.4 11.87,11.96 13.16,11.96 13.21,10.24 18.93,10.24 18.93,11.91 19.26,11.91 19.26,10.41 20.91,10.41
N$20
  Bottom 0.305: 15.27,12.72 U$4.6 15.27,12.72 | 15.27,12.72 14.61,13.39 C5.2
N$21
  Top 0.61: 25.46,14.54 U$6.2
  Top 0.711: U$5.5 25.46,14.54
N$22
  Top 0.61: D2.C R17.1
N$27
  Bottom 0.305: R6.1 20.53,3.86 20.3,3.63 19.18,3.63 18.6,3.05 PTT.A
P$1  (via drill 0.35)
  Top 0.152: v2.6,14.43 2.57,14.43 v1.96,13.82 | v1.96,13.82 1.96,13.84 v1.38,14.43 | v1.38,13.21 1.38,13.23 v1.96,13.82 | v1.96,13.82 1.99,13.82 v2.6,13.21 | v2.6,11.91 v1.96,11.28 | v1.96,11.28 1.96,11.3 v1.38,11.89 | v1.96,11.28 1.96,11.25 v1.38,10.67 | v1.96,11.28 1.99,11.28 v2.6,10.67
  Top 0.61: v2.6,13.21 v2.6,11.91 | v1.38,11.89 v1.38,13.21
PPS
  Bottom 0.305: R1.1 36.3,17.96 37.06,17.2 U$1.4_TIMEPULSE
RFGND  (via drill 0.35, 1 pad 1.68)
  Top 0.61: 1.99,7.06 J$1.GND@1
  other vias: 10.83,3.38 10.06,4.14 9.3,4.9 7.78,6.43 7.02,7.19 6,7.19 4.98,7.16 1.38,1.55
  pour Bottom (isolate 0.508, no thermals): -0.02,7.39 7.02,7.42 11.82,2.59 11.84,0.03 -0.02,0.03
  pour Top (isolate 0.61, no thermals): 0.03,7.34 7.09,7.34 11.72,2.62 11.72,0.1 0.01,0.03
  pour Route2 (rank 2, no thermals): 11.69,0 0.06,0 0.06,7.34 7.04,7.34 11.77,2.59 11.77,0.05
RFOUT  (via drill 1 pad 1.68)
  other vias: 1.38,4.09
RX
  Bottom 0.254: U$4.20 22.06,11.3
  Bottom 0.305: U$4.20 22.06,11.3 22.32,11.56 23.43,11.56 24.04,10.95 R16.1
RX1  (via drill 0.6)
  Route15 0.305: v32.29,16.15 30.36,14.22 28.61,14.22 28.1,13.71 28.1,13.19 v26.68,11.76
  Bottom 0.305: U$1.2_TXD1 34.86,17.14 34.53,17.47 33.03,17.47 32.29,16.74 v32.29,16.15 | v26.68,11.76 26.68,11.18 26.45,10.95 R16.2
SCK  (via drill 0.6)
  Top 0.305: 15.78,16.59 v15.78,16.56 18.75,16.56 FTDI.3
  Bottom 0.254: U$4.9 16.96,13.14
  Bottom 0.305: U$4.9 16.96,13.14 16.85,13.26 15.78,14.33 v15.78,16.56
SCL  (via drill 0.6)
  Top 0.305: U$3.5 21.32,2.49 20.4,3.4 19.44,3.4 18.85,3.99 18.85,5.13 21.47,7.75 23.1,7.75 23.51,8.17 v23.51,12.86 23.53,12.85 24.89,12.85 25.35,12.39 25.35,11.74 24.85,11.24 24.85,7.19 24.98,7.06 25.37,7.06 25.61,7.29 IC1.4 | IC1.4 | IC1.4
  Bottom 0.254: U$4.18 | U$4.18 21.42,12.07
  Bottom 0.305: U$4.18 21.42,12.07 22.15,12.8 23.45,12.8 v23.51,12.86 23.68,12.88 24.88,14.06 | 24.88,14.06 R7.2 24.89,14.06 24.88,14.06
SDA  (via drill 0.6)
  Top 0.305: 24.57,12.09 v24.57,12.06 24.19,11.68 24.19,7.85 23.48,7.14 | 23.48,7.14 21.77,7.14 20.86,6.22 20.86,5.08 23.32,2.6 U$3.6 | 23.48,7.14 23.48,7.04 24.01,6.5 25.73,6.5 26.17,6.93 IC1.3 | IC1.3 | IC1.3
  Bottom 0.254: U$4.19 | U$4.19 21.66,11.6
  Bottom 0.305: U$4.19 21.66,11.6 22.12,12.06 v24.57,12.06 25.48,12.98 25.7,13.22 | 25.7,13.22 R3.2 25.91,13.43 25.7,13.22
SS
  Bottom 0.305: 14.54,18.34 FTDI.6 14.58,17.55 14.99,17.14 14.99,14.43 16.29,13.13 | 16.29,13.13 16.62,12.8 U$4.8 16.29,13.12 16.29,13.13
TX
  Bottom 0.254: U$4.21 22.27,10.8
  Bottom 0.305: U$4.21 22.27,10.8 22.55,11.07 22.89,11.07 23.83,10.14 26.25,10.14 26.65,9.73 28.56,9.73 28.96,10.14 R15.2
TX1  (via drill 0.6)
  Bottom 0.305: U$1.3_RXD1 35.95,15.81 35.95,17.27 35.31,17.91 v32.16,17.91 31.45,17.2 31.45,12.29 31.16,12.02 30.93,11.8 R14.1 29.09,11.75 R15.1
VBACKUP  (via drill 0.6)
  Top 0.61: R17.2 41.35,9.26 | 41.35,9.26 40.77,9.83 40.77,15.21 39.2,16.78 | 39.2,16.78 C3.1 | v39.22,17.32 39.2,17.3 39.2,16.78 | C17.2 41.36,9.25 41.35,9.26
  Bottom 0.61: U$1.6_V_BCKP 39.26,17.11 39.25,17.12 39.25,17.3 v39.22,17.32
VCC  (via drill 0.6)
  Top 0.203: U$5.3 28.93,16.44 28.91,16.46 28.66,16.2 28.66,14.76 28.87,14.54 U$5.1
  Top 0.61: L1.2 12.83,13.49
  Top 0.813: 12.83,13.49 v11.92,14.4
  Bottom 0.152: C9.2 10.15,15.15
  Bottom 0.254: U$4.24 22.16,8.69 | U$4.14 20.03,13.51 | C2.2 | C2.2 11.72,9.14
  Bottom 0.305: U$4.44 14.29,9.18 | 14.29,9.18 14.58,9.47 15.12,9.47 | 15.12,9.47 18.26,6.34 18.26,6.01 17.76,5.5 U$4.34 | FTDI.2 22.27,18.4 20.45,16.56 20.45,13.93 20.03,13.51 U$4.14 19.66,13.13 18.85,12.32 18.85,11.58 21.34,9.09 21.73,9.09 U$4.24 22.16,8.69 22.66,8.18 23.7,8.18 24.01,7.87 C4.2 | 14.86,10.31 U$4.2 14.86,10.31 | 14.86,10.31 15.12,10.05 15.12,9.47 | U$4.34 | 15.69,13.02 U$4.7 15.69,13.02 | 15.69,13.02 14.3,14.4 v11.92,14.4 | U$4.34 17.23,5.05 17.23,4.8 17.86,4.17 v17.94,4.17 | U$4.44 13.79,8.69 13.24,8.69 12.35,9.4 11.97,9.4 11.72,9.14 C2.2 | U$4.44 14.29,9.18 | C4.2 | 14.86,10.31
  Bottom 0.406: R5.2 11.92,15.12 v11.92,14.4 11.39,13.87 F1.2 | 28.45,3.9 U$2.VCC | C10.2 28.47,3.47
  Bottom 0.61: F1.2 10.15,15.15 | 28.45,3.9 28.45,4.05 C10.2
  other vias: 29.42,17.45
  pour Route15: -0.02,19.56 26.37,19.61 32.34,19.56 43.92,19.56 43.92,4.04 39.96,4.04 39.96,0.13 12.43,0 12.4,0.03 12.4,2.92 7.35,7.98 0.06,7.98
  pour Top (rank 2, no thermals): 29.01,17.83 31.43,17.83 31.43,16.26 29.01,16.26
VIN
  Top 0.406: R8.2 18.16,12.96 LT3426.6 17.71,11.68 L2.1 14.68,12.3
  Top 0.61: C8.1 14.68,12.3
  Bottom 0.254: R13.1
  Bottom 0.305: R13.1 13.37,4.78 13.11,4.52 12.76,4.52 6.08,11.2 J1.2
  pour Top (isolate 0.305, rank 2, no thermals): 11.92,14.43 12.81,14.43 13.77,13.51 13.75,10.85 18.29,10.85 18.29,12.09 18.55,12.52 18.55,13.31 14.97,13.26 14.92,15.06 14.28,15.09 13.98,15.37 12.86,16.51 8.95,16.51 6.64,16.48 5.04,16.48 4.98,14.5 8.08,14.45 9.07,14.48
VSENSE
  Bottom 0.254: C6.2 12.73,3.28 12.96,3.5 | R13.2 14.61,6.02
  Bottom 0.305: R13.2 14.61,6.02 14.61,7.39 14.82,7.6 14.83,7.6 14.98,7.76 | 14.98,7.76 U$4.41 14.98,7.76 | 14.98,7.76
  Bottom 0.406: R13.2 14.84,5.54 14.84,5.08 13.62,3.86 13.31,3.86 12.96,3.5 12.81,3.35 C6.2
XTAL1
  Bottom 0.152: Y1.1
  Bottom 0.254: U$4.17 | U$4.17 20.94,12.29
  Bottom 0.305: U$4.17 20.94,12.29 22.01,13.37 22.68,13.85 Y1.1
XTAL2
  Bottom 0.152: Y1.3 | Y1.3 20.98,15.54
  Bottom 0.254: U$4.16 | U$4.16 20.61,12.67
  Bottom 0.305: U$4.16 20.61,12.67 21.47,13.53 21.47,14.3 20.98,14.79 20.98,15.54 Y1.3

### Text on the board
tNames: + | I2C | Tracksoar v2 | A1 | A0 | D9 | D8 | SCL | SDA | <3 Swiss
bNames: GND | TX | 5V | 3V | !RESET | SS | MISO | SCK | RX | SPI | MOSI